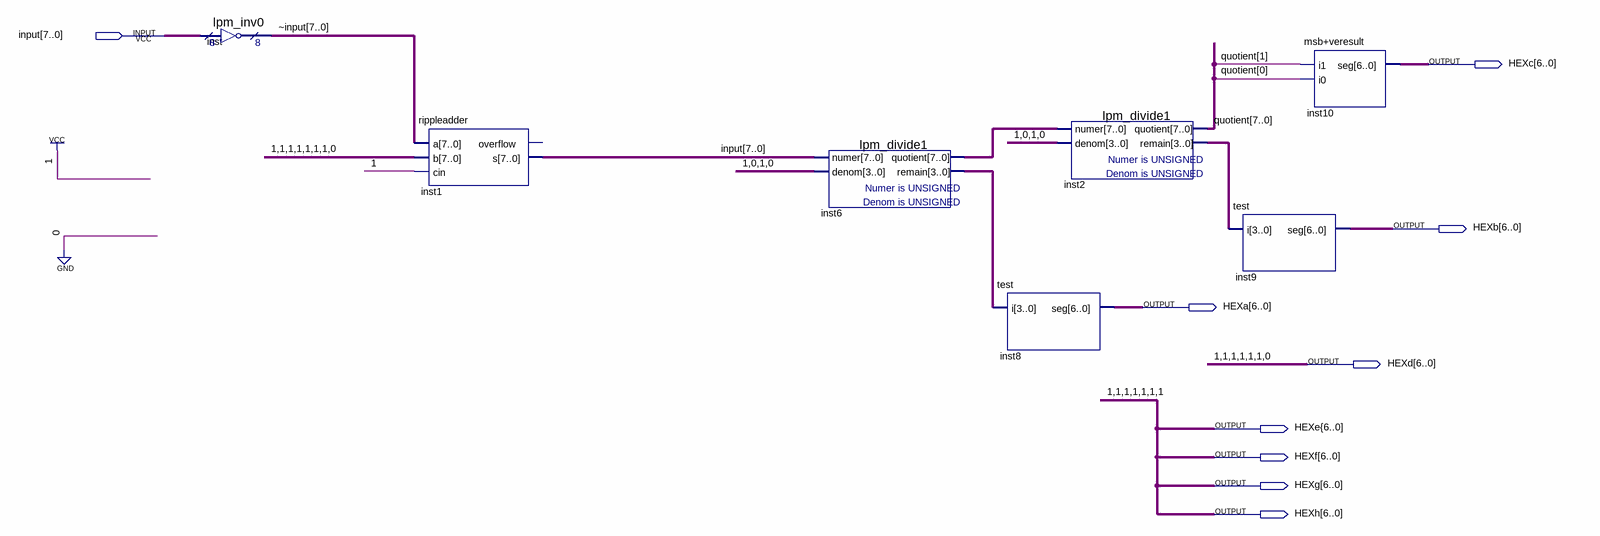
[diagram p0: schematic sheet]
// Quartus schematic -veaddmodule.bdf as structural Verilog: 7 symbols, 9 pins
module \-veaddmodule  (
  input  [7:0] \input ,
  output [6:0] HEXc,
  output [6:0] HEXb,
  output [6:0] HEXa,
  output [6:0] HEXd,
  output \HEXe{6..0] ,
  output [6:0] HEXf,
  output [6:0] HEXg,
  output [6:0] HEXh
);

  wire [3:0] inst2_remain, inst6_remain;
  wire [7:0] inst6_quotient, quotient, \~input ;

  lpm_inv0 inst (.data(\input ), .result(\~input ));
  rippleadder inst1 (.a(\~input ), .b(8'b11111110), .cin(1'b1), .s(\input ));  // open: overflow
  lpm_divide1 inst6 (.numer(\input ), .denom(4'b1010), .quotient(inst6_quotient), .remain(inst6_remain));
  test inst8 (.i(inst6_remain), .seg(HEXa));
  lpm_divide1 inst2 (.numer(inst6_quotient), .denom(4'b1010), .quotient(quotient), .remain(inst2_remain));
  test inst9 (.i(inst2_remain), .seg(HEXb));
  \msb+veresult  inst10 (.i1(quotient[1]), .i0(quotient[0]), .seg(HEXc));

  assign HEXd = 7'b1111110;
  assign HEXf = {7{1'b1}};
  assign HEXg = {7{1'b1}};
  assign HEXh = {7{1'b1}};
endmodule
